# EAGLE design Deneme_Devresi-08.12.2024-Şematik - Kopya (EAGLE 9.6.0)
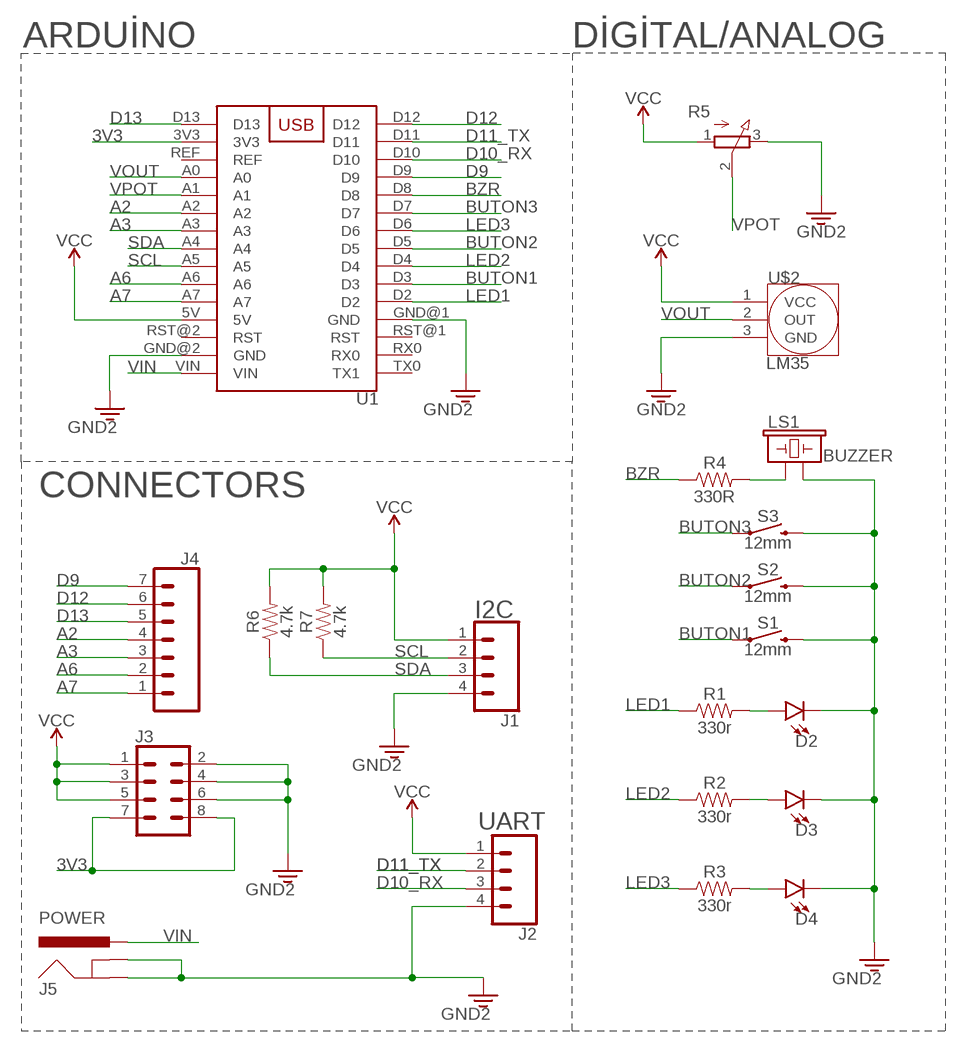
[diagram p0: schematic, sheet 1]

## Parts
D2  LED-3MM-NO_SILK  [LED_3MM-NS]
D3  LED-3MM-NO_SILK  [LED_3MM-NS]
D4  LED-3MM-NO_SILK  [LED_3MM-NS]
J1  CONN_04JST-PTH  [JST-4-PTH]
J2  CONN_04JST-PTH  [JST-4-PTH]
J3  CONN_04X2  [2X4]
J4  CONN_07NO_SILK  [1X07_NO_SILK]
J5  POWER  POWER_JACKPOWER_JACK_SLOT_NO_SILK_OVRHNG  [POWER_JACK_PTH_SLOT_NO_OVRHNG_SILK]
LS1  BUZZER  BUZZER-PTH_NO_SILK  [BUZZER-12MM-NS]
R1  330r  1KOHM-HORIZ-1/4W-5%  [AXIAL-0.3]
R2  330r  1KOHM-HORIZ-1/4W-5%  [AXIAL-0.3]
R3  330r  1KOHM-HORIZ-1/4W-5%  [AXIAL-0.3]
R4  330R  1KOHM-HORIZ-1/4W-5%  [AXIAL-0.3]
R5  3RP/1610N  [3RP/1610N]
R6  4.7k  1KOHM-HORIZ-1/4W-5%  [AXIAL-0.3]
R7  4.7k  1KOHM-HORIZ-1/4W-5%  [AXIAL-0.3]
S1  12mm  MOMENTARY-SWITCH-SPST-PTH-12MM  [TACTILE_SWITCH_PTH_12MM]
S2  12mm  MOMENTARY-SWITCH-SPST-PTH-12MM  [TACTILE_SWITCH_PTH_12MM]
S3  12mm  MOMENTARY-SWITCH-SPST-PTH-12MM  [TACTILE_SWITCH_PTH_12MM]
U1  ARDUINO_NANO  [ARDUINO_NANO]
U$2  LM35  [TO-92]

## Nets
3V3: J3.7 J3.8 U1.3V3
A2: J4.4 U1.A2
A3: J4.3 U1.A3
A6: J4.2 U1.A6
A7: J4.1 U1.A7
BUTON1: S1.1 U1.D3
BUTON2: S2.1 U1.D5
BUTON3: S3.1 U1.D7
BZR: R4.P$1 U1.D8
D9: J4.7 U1.D9
D10_RX: J2.3 U1.D10
D11_TX: J2.2 U1.D11
D12: J4.6 U1.D12
D13: J4.5 U1.D13
GND: D2.K(C) D3.K(C) D4.K(C) J1.4 J2.4 J3.2 J3.4 J3.6 J5.GND J5.GNDBREAK LS1.- R5.3(E) S1.3 S2.3 S3.3 U1.GND@1(GND) U1.GND@2(GND) U$2.3(GND) ; supply symbol labelled GND2
LED1: R1.P$1 U1.D2
LED2: R2.P$1 U1.D4
LED3: R3.P$1 U1.D6
N$2: LS1.+ R4.P$2
N$6: D4.A R3.P$2
N$7: D3.A R2.P$2
N$8: D2.A R1.P$2
SCL: J1.2 R7.P$1 U1.A5
SDA: J1.3 R6.P$1 U1.A4
VCC: J1.1 J2.1 J3.1 J3.3 J3.5 R5.1(A) R6.P$2 R7.P$2 U1.5V U$2.1(VCC)
VIN: J5.PWR U1.VIN
VOUT: U1.A0 U$2.2(OUT)
VPOT: R5.2(S) U1.A1
Unconnected: U1.REF U1.RST@1(RST) U1.RST@2(RST) U1.RX0 U1.TX0(TX1)

## Notes on the sheet
- ARDUİNO | DİGİTAL/ANALOG
- CONNECTORS
- I2C
- UART

## Library data of the parts
D2-D4 = SparkFun-LED:LED: LED (Generic) Standard schematic elements and footprints for 5mm, 3mm, 1206, and 0603 sized LEDs. Generic LEDs with no color specified.
J1 J2 = SparkFun-Connectors:CONN_04: Multi connection point. Often used as Generic Header-pin footprint for 0.1 inch spaced/style header connections On any of the 0.1 inch spaced packages, you can populate with these: Break Away Headers - Straight <https://www.sparkfun.com/products/116> (PRT-00116) Break Away Male Headers - Right Angle <https://www.sparkfun.com/products/553> (PRT-00553) Female Headers <https://www.sparkfun.com/products/115> (PRT-00115) Break Away Headers - Machine Pin <https://www.sparkfun.com/products/117> (PRT-00117) Break Away Female Headers - Swiss Machine Pin <https://www.sparkfun.com/products/743> (PRT-00743) For SCREWTERMINALS and SPRING TERMINALS visit here: Screw Terimnals on SparkFun.com <https://www.sparkfun.com/search/results?term=Screw+Terminals> (5mm/3.5mm/2.54mm spacing) This device is also useful as a general connection point to wire up your design to another part of your project. Our various solder wires solder well into these plated through hole pads. Hook-Up Wire - Assortment (Stranded, 22 AWG) <https://www.sparkfun.com/products/11375> (PRT-11375) Hook-Up Wire - Assortment (Solid Core, 22 AWG) <https://www.sparkfun.com/products/11367> (PRT-11367) View the entire wire category on our website here <https://www.sparkfun.com/categories/141> Special notes: Molex polarized connector foot print use with SKU : PRT-08231 with associated crimp pins and housings. 1MM SMD Version SKU: PRT-10208; PROD_ID: WIRE-13531; SF_ID: PRT-09916
J3 = SparkFun-Connectors:CONN_04X2: Multi connection point. Often used as Generic Header-pin footprint for 0.1 inch spaced/style header connections On any of the 0.1 inch spaced packages, you can populate with these: Break Away Headers - Straight <https://www.sparkfun.com/products/116> (PRT-00116) Break Away Male Headers - Right Angle <https://www.sparkfun.com/products/553> (PRT-00553) Female Headers <https://www.sparkfun.com/products/115> (PRT-00115) Break Away Headers - Machine Pin <https://www.sparkfun.com/products/117> (PRT-00117) Break Away Female Headers - Swiss Machine Pin <https://www.sparkfun.com/products/743> (PRT-00743)
J4 = SparkFun-Connectors:CONN_07: Multi connection point. Often used as Generic Header-pin footprint for 0.1 inch spaced/style header connections On any of the 0.1 inch spaced packages, you can populate with these: Break Away Headers - Straight <https://www.sparkfun.com/products/116> (PRT-00116) Break Away Male Headers - Right Angle <https://www.sparkfun.com/products/553> (PRT-00553) Female Headers <https://www.sparkfun.com/products/115> (PRT-00115) Break Away Headers - Machine Pin <https://www.sparkfun.com/products/117> (PRT-00117) Break Away Female Headers - Swiss Machine Pin <https://www.sparkfun.com/products/743> (PRT-00743) For SCREWTERMINALS and SPRING TERMINALS visit here: Screw Terimnals on SparkFun.com <https://www.sparkfun.com/search/results?term=Screw+Terminals> (5mm/3.5mm/2.54mm spacing) This device is also useful as a general connection point to wire up your design to another part of your project. Our various solder wires solder well into these plated through hole pads. Hook-Up Wire - Assortment (Stranded, 22 AWG) <https://www.sparkfun.com/products/11375> (PRT-11375) Hook-Up Wire - Assortment (Solid Core, 22 AWG) <https://www.sparkfun.com/products/11367> (PRT-11367) View the entire wire category on our website here <https://www.sparkfun.com/categories/141> Special notes: Molex polarized connector foot print use with SKU : PRT-08231 with associated crimp pins and housings. 1MM SMD Version SKU: PRT-10208 NOTES ON THE VARIANTS LOCK and LOCK_LONGPADS... This footprint was designed to help hold the alignment of a through-hole component (i.e. 6-pin header) while soldering it into place. You may notice that each hole has been shifted either up or down by 0.005 of an inch from it's more standard position (which is a perfectly straight line). This slight alteration caused the pins (the squares in the middle) to touch the edges of the holes. Because they are alternating, it causes a "brace" to hold the component in place. 0.005 has proven to be the perfect amount of "off-center" position when using our standard breakaway headers. Although looks a little odd when you look at the bare footprint, once you have a header in there, the alteration is very hard to notice. Also,if you push a header all the way into place, it is covered up entirely on the bottom side.
J5 = SparkFun-Connectors:POWER_JACK: Power Jack Connector This is the standard 5.5mm barrel jack for power. The PTH is the most common, proven, reliable, footprint. The Slot footprint only works if the mill layer is transmitted to the PCB fab house so be warned. Here are the connectors we sell at SparkFun: DC Barrel Power Jack/Connector <https://www.sparkfun.com/products/119> (PRT-00119) DC Barrel Power Jack/Connector (SMD) <https://www.sparkfun.com/products/12748> (PRT-12748) DC Barrel Jack Adapter - Breadboard Compatible <https://www.sparkfun.com/products/10811> (PRT-10811) It is used on this SparkFun product (and many, many others): SparkFun RedBoard - Programmed with Arduino <https://www.sparkfun.com/products/12757> (DEV-12757) Also, if you need a mating power supply or connector, please check these out: Wall Adapter Power Supply - 9VDC 650mA <https://www.sparkfun.com/products/298> (TOL-00298) DC Barrel Jack Adapter - Male <https://www.sparkfun.com/products/10287> (PRT-10287)
LS1 = SparkFun-Electromechanical:BUZZER: Buzzer Small round buzzers that operate around the audible 2kHz range. You can use these as speakers to create simple music or user interfaces. Variant Overview: PTH - Mini Speaker - PC Mount 12mm 2.048kHz <https://www.sparkfun.com/products/7950> PTH_KIT - Mini Speaker - PC Mount 12mm 2.048kHz <https://www.sparkfun.com/products/7950> KIT simplifies soldering by adding stop mask to one side of the pads. PTH_NO_SILK - Mini Speaker - PC Mount 12mm 2.048kHz <https://www.sparkfun.com/products/7950> No silkscreen indicator of buzzer outline. PTH_KIT_NO_SILK - Mini Speaker - PC Mount 12mm 2.048kHz <https://www.sparkfun.com/products/7950> KIT package w/o silkscreen SMD - Buzzer Audio Magnetic (CCV-084B16) SMD buzzer used on, e.g. the LilyPad Buzzer <https://www.sparkfun.com/products/8463> and RFID USB Reader <https://www.sparkfun.com/products/9963>. SMD_KIT - Buzzer Audio Magnetic (CCV-084B16) SMD Buzzer with elongated pins to make soldering easier. Used on the SparkFun Simon Says - Surface Mount Soldering Kit <https://www.sparkfun.com/products/10935>. SMD-SQUARE - Buzzer Audio Magnetic (COMP-15701) SMT square buzzer with one chamfered corner.; PROD_ID: COMP-08253; SF_SKU: COM-07950
R1-R4 R6 R7 = SparkFun-Resistors:1KOHM: 1kΩ resistor A resistor is a passive two-terminal electrical component that implements electrical resistance as a circuit element. Resistors act to reduce current flow, and, at the same time, act to lower voltage levels within circuits. - Wikipedia; PROD_ID: RES-08380; VALUE: 1k
R5 = pot:3RP/1610N: 16mm Potentiometer one level Source: http://www.alphapotentiometers.net/html/16mm_pot_2.html
S1-S3 = SparkFun-Switches:MOMENTARY-SWITCH-SPST: Momentary Switch (Pushbutton) - SPST Normally-open (NO) SPST momentary switches (buttons, pushbuttons). Variants PTH-12MM - 12mm square, through-hole Momentary Pushbutton Switch - 12mm Square <https://www.sparkfun.com/products/9190> (COM-09190) PTH-6.0MM, PTH-6.0MM-KIT - 6.0mm square, through-hole Mini Pushbutton Switch <https://www.sparkfun.com/products/97> (COM-00097) KIT package intended for soldering kit's - only one side of pads' copper is exposed. PTH-RIGHT-ANGLE-KIT - Right-angle, through-hole Right Angle Tactile Button <https://www.sparkfun.com/products/10791> - Used on SparkFun BigTime Watch Kit <https://www.sparkfun.com/products/11734> SMD-12MM - 12mm square, surface-mount Tactile Button - SMD (12mm) <https://www.sparkfun.com/products/12993> (COM-12993) Used on SparkFun PicoBoard <https://www.sparkfun.com/products/11888> SMD-4.5MM - 4.5mm Square Trackball Switch Used on SparkFun Blackberry Trackballer Breakout <https://www.sparkfun.com/products/13169> SMD-4.6MMX2.8MM - 4.60mm x 2.80mm, surface mount Used on SparkFun Pro Micro - RP2040 <https://www.sparkfun.com/products/17717> SMD-5.2MM, SMD-5.2-REDUNDANT - 5.2mm square, surface-mount Mini Pushbutton Switch - SMD <https://www.sparkfun.com/products/8720> (COM-08720) Used on Arduino Pro Mini <https://www.sparkfun.com/products/11114> REDUNDANT package connects both switch circuits together SMD-6.0X3.5MM - 6.0 x 3.5mm, surface mount Momentary Reset Switch SMD <https://www.sparkfun.com/products/8229> (COM-08229) SMD-6.2MM-TALL - 6.2mm square, surface mount Tactile Button - SMD (6mm) <https://www.sparkfun.com/products/12992> Used on SparkFun Digital Sandbox <https://www.sparkfun.com/products/12651> SMD-RIGHT-ANGLE - Right-angle, surface mount Used on SparkFun Block for Intel® Edison - Arduino <https://www.sparkfun.com/products/13036>; PROD_ID: SWCH-09185; SF_SKU: COM-09190
U1 = EfeEvrenLib:ARDUINO_NANO: Arduino Nano Device
U$2 = EfeEvrenLib - Kopya:LM35

## Board
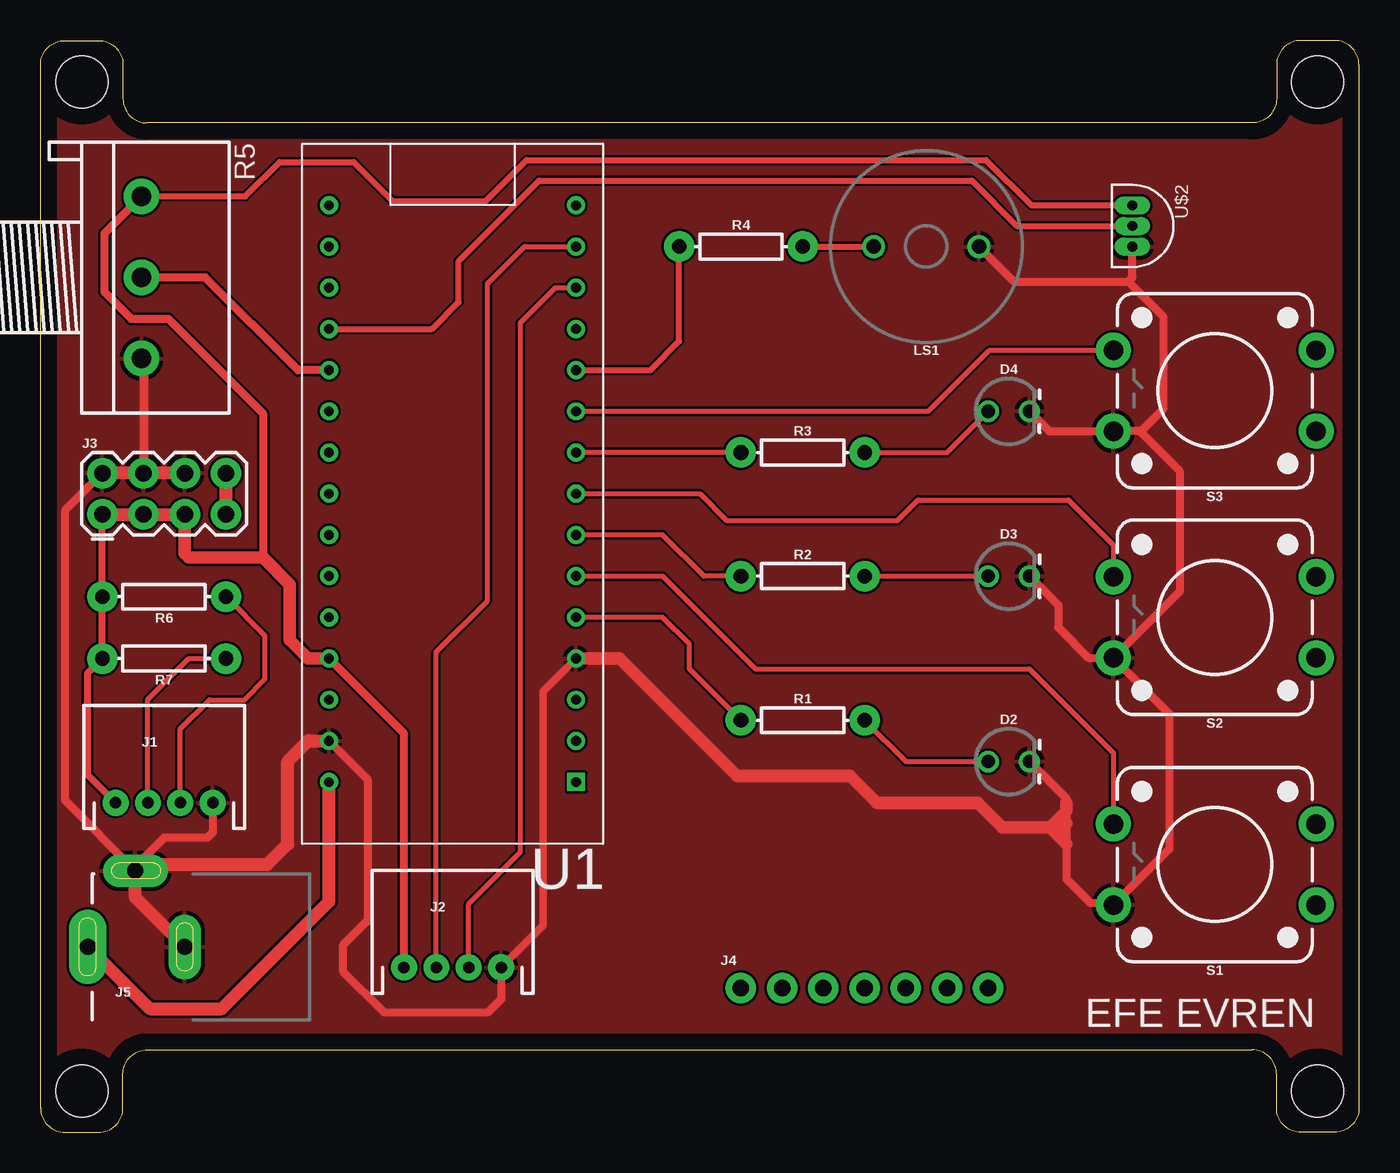
[diagram p1: board, top side]
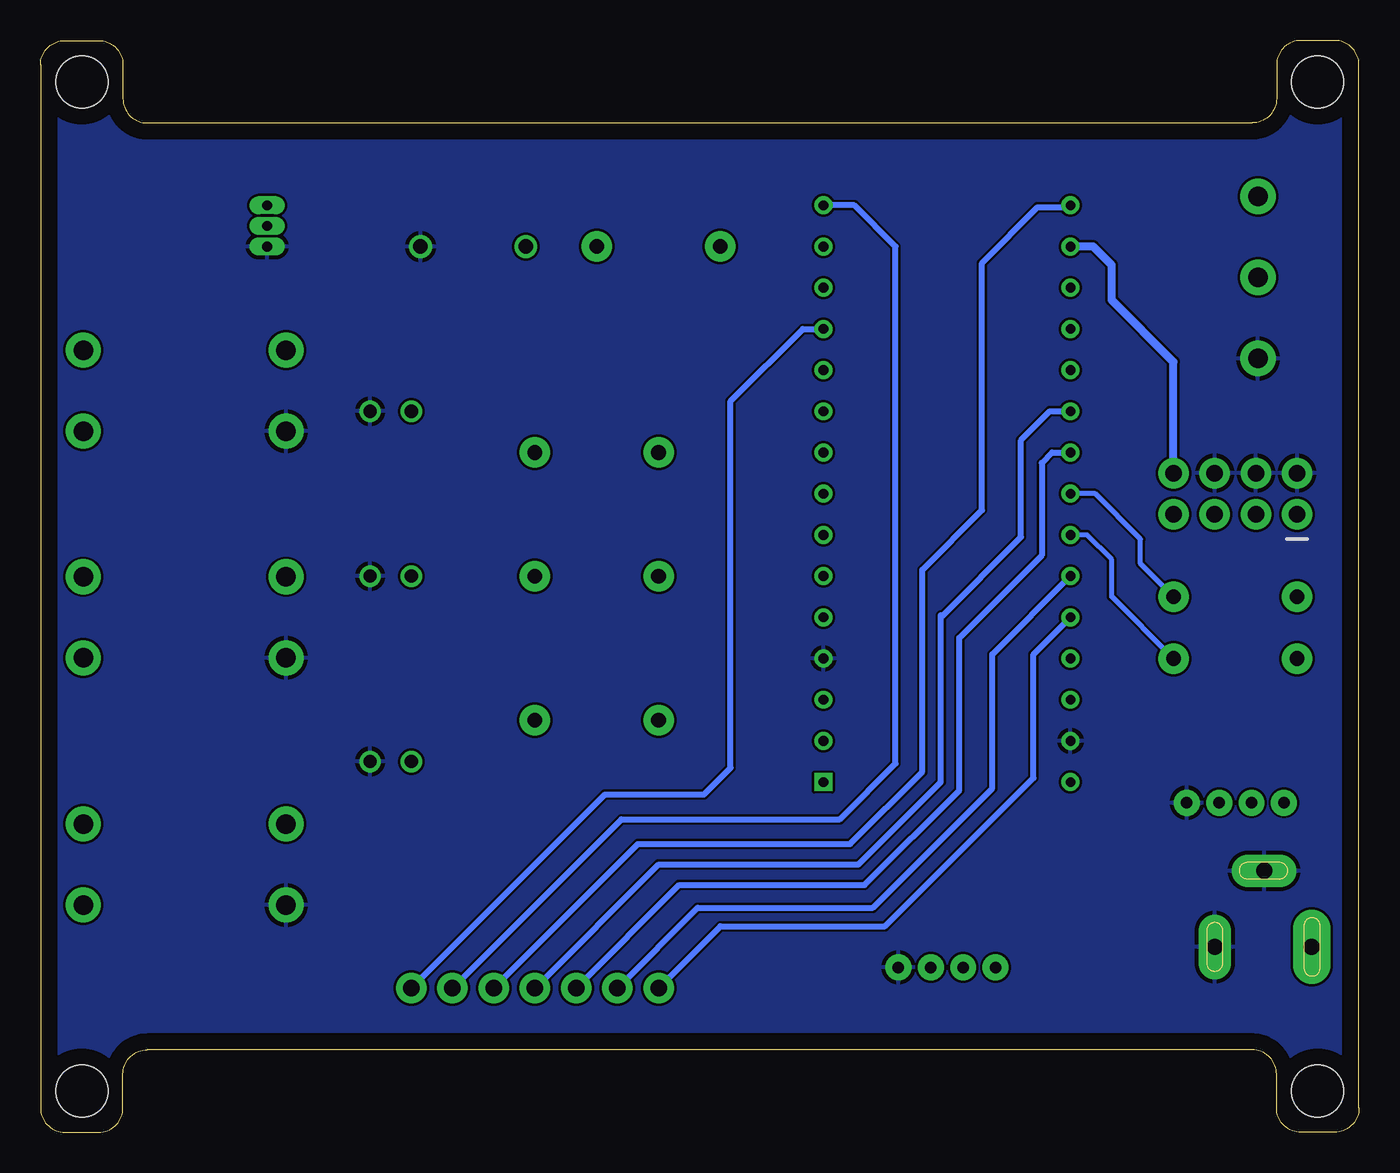
[diagram p2: board, bottom side, seen from below]

Size 81.28 x 67.31 mm. Coordinates in mm from the lower left corner, seen from the top.
Outline: 0,1.5 0,65.81 arc-90 1.5,67.31 3.58,67.31 arc-90 5.08,65.81 5.08,63.73 arc90 6.58,62.23 74.7,62.23 arc90 76.2,63.73 76.2,65.81 arc-90 77.7,67.31 79.78,67.31 arc-90 81.28,65.81 81.28,1.5 arc-90 79.78,0 77.7,0 arc-90 76.2,1.5 76.2,3.58 arc90 74.7,5.08 6.58,5.08 arc90 5.08,3.58 5.08,1.5 arc-90 3.58,0 1.5,0 arc-90 0,1.5
Copper layers (1*16): Top 0.035mm / dielectric 1.5mm / Bottom 0.035mm
Design rules "default - Kopya": minimum track width 6mil, minimum drill 0.35mm, track to track 6mil, track to pad 6mil, pad to pad 6mil, via to via 6mil, smd to smd 6mil, copper to edge 40mil, drill to drill 6mil, minimum pad ring 10mil, minimum via ring 8mil, stop-mask expansion 4mil, vias tented up to drill 0mil, thermal gap 10mil
Holes 3.2 mm at 2.54,64.77 78.74,64.77 78.74,2.54 2.54,2.54

### Footprints (pad centres in the part's own frame; a part is rotated, then mirrored left to right if it is on the bottom)
LED_3MM-NS = drill 0.813: A -1.27,0; K 1.27,0
JST-4-PTH = drill 0.7 pad 1.6: 1 -3,0; 2 -1,0; 3 1,0; 4 3,0
2X4 = drill 1.016 pad 1.88: 1 -3.81,-1.27; 2 -3.81,1.27; 3 -1.27,-1.27; 4 -1.27,1.27; 5 1.27,-1.27; 6 1.27,1.27; 7 3.81,-1.27; 8 3.81,1.27
1X07_NO_SILK = drill 1.016 pad 1.88: 1 0,0; 2 2.54,0; 3 5.08,0; 4 7.62,0; 5 10.16,0; 6 12.7,0; 7 15.24,0
POWER_JACK_PTH_SLOT_NO_OVRHNG_SILK = drill 1 pad 2 long: GND 0,0; GNDBREAK -3.048,4.699 | drill 1 pad 2.3 long: PWR -5.969,0
BUZZER-12MM-NS = drill 0.9: + 3.25,0; - -3.25,0
AXIAL-0.3 = drill 0.9 pad 1.88: P$1 -3.81,0; P$2 3.81,0
3RP/1610N = drill 1.2 pad 2.184: 1 -5,0; 2 0,0; 3 5,0
TACTILE_SWITCH_PTH_12MM = drill 1.2 pad 2.159: 1 6.25,-2.5; 2 -6.25,-2.5; 3 6.25,2.5; 4 -6.25,2.5
ARDUINO_NANO = drill 0.6: 3V3 7.62,-15.24; 5V 7.62,10.16; A0 7.62,-10.16; A1 7.62,-7.62; A2 7.62,-5.08; A3 7.62,-2.54; A4 7.62,0; A5 7.62,2.54; A6 7.62,5.08; A7 7.62,7.62; D2 -7.62,7.62; D3 -7.62,5.08; D4 -7.62,2.54; D5 -7.62,0; D6 -7.62,-2.54; D7 -7.62,-5.08; D8 -7.62,-7.62; D9 -7.62,-10.16; D10 -7.62,-12.7; D11 -7.62,-15.24; D12 -7.62,-17.78; D13 7.62,-17.78; GND@1 -7.62,10.16; GND@2 7.62,15.24; REF 7.62,-12.7; RST@1 -7.62,12.7; RST@2 7.62,12.7; RX0 -7.62,15.24; VIN 7.62,17.78 | drill 0.6 square: TX0 -7.62,17.78
TO-92 = drill 0.6 long: 1 -10.16,1.27; 2 -8.89,1.27; 3 -7.62,1.27

### Placement (x,y rotation side)
D2  59.69,22.86 0 top
D3  59.69,34.29 0 top
D4  59.69,44.45 0 top
J1  7.62,20.32 0 top
J2  25.4,10.16 0 top
J3  7.62,39.37 0 top
J4  43.18,8.89 0 top
J5  8.89,11.43 0 top
LS1  54.61,54.61 180 top
R1  46.99,25.4 0 top
R2  46.99,34.29 0 top
R3  46.99,41.91 0 top
R4  43.18,54.61 0 top
R5  6.22,52.7 270 top
R6  7.62,33.02 180 top
R7  7.62,29.21 180 top
S1  72.39,16.51 180 top
S2  72.39,31.75 180 top
S3  72.39,45.72 180 top
U1  25.4,39.37 180 top
U$2  66.04,46.99 270 top

### Tracks (layer width: path | path; a pad name or v marks a point on that pad's centre or on a via)
3V3
  Top 0.813: J3.7 J3.8
  Bottom 0.508: J3.8 11.43,47.5 15.24,51.31 15.24,53.47 16.38,54.61 U1.3V3
A2
  Bottom 0.356: J4.4 43.18,16.51 30.86,16.51 25.78,21.59 25.78,31.75 | 25.78,31.75 25.78,31.88 | 25.78,31.75 20.83,36.7 20.83,42.67 19.05,44.45 U1.A2
A3
  Bottom 0.356: J4.3 41.91,15.24 30.48,15.24 24.64,21.08 24.64,30.48 19.56,35.56 19.56,41.27 18.92,41.91 U1.A3
A6
  Bottom 0.356: J4.2 40.77,13.84 29.97,13.84 22.61,21.21 22.61,29.46 U1.A6
A7
  Bottom 0.356: J4.1 39.37,12.7 29.21,12.7 20.07,21.84 20.07,29.46 U1.A7
BUTON1
  Top 0.305: U1.D3 38.35,34.29 44.07,28.57 60.96,28.57 66.14,23.4 S1.1
BUTON2
  Top 0.305: U1.D5 40.64,39.37 42.29,37.72 52.83,37.72 54.1,38.99 63.37,38.99 66.14,36.22 S2.1
BUTON3
  Top 0.305: U1.D7 54.74,44.45 58.51,48.22 S3.1
BZR
  Top 0.356: U1.D8 37.59,46.99 39.37,48.77 R4.P$1
D9
  Bottom 0.356: J4.7 46.48,20.83 40.39,20.83 38.73,22.48 38.73,45.09 34.29,49.53 U1.D9
D10_RX
  Top 0.305: J2.3 26.4,14.08 29.59,17.27 29.59,49.91 31.75,52.07 U1.D10
D11_TX
  Top 0.305: J2.2 24.4,29.61 27.56,32.77 27.56,52.32 29.84,54.61 U1.D11
D12
  Bottom 0.356: J4.6 45.47,19.3 32,19.3 28.58,22.73 28.58,54.61 31.12,57.15 U1.D12
D13
  Bottom 0.356: J4.5 44.45,17.78 31.37,17.78 26.92,22.23 26.92,34.67 23.24,38.35 23.24,53.59 19.81,57.02 17.91,57.02 U1.D13
GND
  Top 0.457: J2.4 30.99,12.75 30.99,27.18 U1.GND@1
  Top 0.508: LS1.- 60.02,52.45 67.06,52.45 | 67.06,52.45 67.31,52.7 U$2.3 | 67.06,52.45 69.22,50.29 69.22,44.58 67.86,43.22 | 67.86,43.22 S3.3 62.19,43.22 D4.K | 67.86,43.22 67.86,43.14 70.23,40.77 70.23,33.34 S2.3 | S2.3 69.6,25.79 69.6,17.47 66.26,14.13 | 66.26,14.13 S1.3 | D3.K 62.74,32.51 62.74,31.12 64.6,29.25 S2.3 | D2.K 63.25,20.57 63.25,20.32 63.25,19.05 63.25,17.78 63.25,15.62 64.74,14.13 66.26,14.13 | J2.4 28.4,8.21 27.56,7.37 21.21,7.37 18.67,9.91 18.67,11.56 20.19,13.08 20.19,21.72 U1.GND@2 | J1.4 10.62,18.49 10.29,18.16 7.62,18.16 5.84,16.38 J5.GNDBREAK 1.52,20.45 1.52,38.35 J3.2
  Top 0.559: R5.3 6.35,47.58 J3.4
  Top 0.762: U1.GND@1 35.69,29.21 42.93,21.97 49.91,21.97 51.56,20.32 57.79,20.32 59.31,18.8 62.23,18.8 | 62.23,18.8 63.25,19.81 63.25,20.32 | 62.23,18.8 63.25,17.78 | 62.23,18.8 62.99,18.8 63.25,19.05
  Top 0.813: J5.GND 5.84,14.48 J5.GNDBREAK 6.22,16.51 13.97,16.51 15.24,17.78 15.24,22.86 16.51,24.13 U1.GND@2 | J3.6 J3.4 J3.2
  pour Top: -3.81,68.58 -3.81,-2.54 83.82,-2.54 83.82,68.58
  pour Bottom: -2.54,68.58 -2.54,-2.54 83.82,-2.54 83.82,69.85 -2.54,69.85
LED1
  Top 0.305: R1.P$1 40.01,28.57 40.01,30.1 38.35,31.75 U1.D2
LED2
  Top 0.305: R2.P$1 40.89,34.29 38.35,36.83 U1.D4
LED3
  Top 0.305: R3.P$1 U1.D6
N$2
  Top 0.356: R4.P$2 LS1.+
N$6
  Top 0.305: R3.P$2 55.88,41.91 D4.A
N$7
  Top 0.305: R2.P$2 D3.A
N$8
  Top 0.305: R1.P$2 53.34,22.86 D2.A
SCL
  Top 0.305: J1.2 6.62,26.69 9.14,29.21 R7.P$1
  Bottom 0.305: R7.P$1 15.24,33.02 15.24,35.31 16.76,36.83 U1.A5
SDA
  Top 0.305: J1.3 8.62,24.88 10.41,26.67 12.57,26.67 13.84,27.94 13.84,30.61 R6.P$1
  Bottom 0.305: R6.P$1 13.46,35.05 13.46,36.58 16.26,39.37 U1.A4
VCC
  Top 0.356: R5.1 12.62,57.71 14.73,59.82 19.3,59.82 21.72,57.4 27.43,57.4 29.97,59.94 58.29,59.94 61.09,57.15 U$2.1
  Top 0.432: J1.1 2.92,22.02 2.92,28.32 R7.P$2 R6.P$2 J3.1
  Top 0.508: J2.1 22.4,24.59 U1.5V | R5.1 3.94,55.42 3.94,51.82 5.59,50.16 7.87,50.16 13.72,44.32 13.72,35.43
  Top 0.762: J3.5 8.89,35.69 9.14,35.43 13.72,35.43 15.37,33.78 15.37,30.35 16.51,29.21 U1.5V
  Top 0.813: J3.1 J3.3 J3.5
VIN
  Top 0.813: J5.PWR 6.73,7.62 11.18,7.62 17.78,14.22 U1.VIN
VOUT
  Top 0.356: U1.A0 24.13,49.53 25.78,51.18 25.78,53.72 30.73,58.67 57.4,58.67 60.2,55.88 U$2.2
VPOT
  Top 0.508: U1.A1 15.88,46.99 10.16,52.7 R5.2

### Text on the board
tNames: EFE EVREN